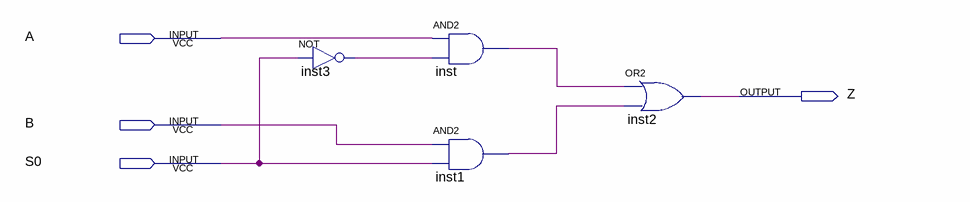
[diagram p0: schematic sheet]
// Quartus schematic mux_2_1.bdf as structural Verilog: 4 symbols, 4 pins
module mux_2_1 (
  input  A,
  input  B,
  input  S0,
  output Z
);

  wire inst1_out, inst3_out, inst_out;

  not inst3 (inst3_out, S0);
  and inst (inst_out, A, inst3_out);
  and inst1 (inst1_out, B, S0);
  or inst2 (Z, inst_out, inst1_out);
endmodule
